# EAGLE schematic test_esp32 (EAGLE 7.5.0)
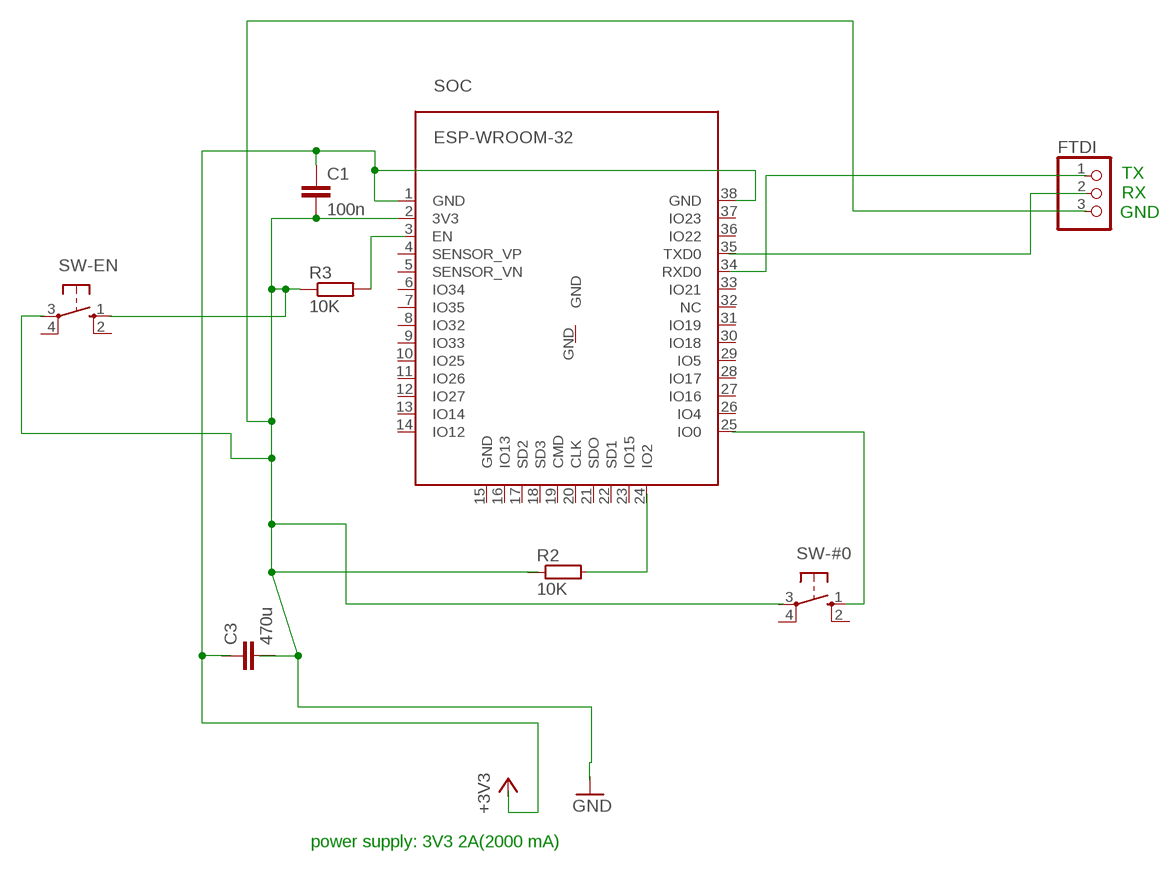
[diagram p0: schematic, sheet 1]

## Parts
C1  100n  C-EUC0603  [C0603]
C3  470u  C-EUC1206  [C1206]
FTDI  PINHD-1X3  [1X03]
R2  10K  R-EU_R0603  [R0603]
R3  10K  R-EU_R0603  [R0603]
SOC  ESP-WROOM-32  [ESP-WROOM-32]
SW-#0  10-XX  [B3F-10XX]
SW-EN  10-XX  [B3F-10XX]

## Nets
N$2: C1.1 SOC.1(GND) SOC.38(GND)
N$4: R3.2
N$9: C1.2 R3.1 SOC.2(3V3)
Unconnected: C3.1 C3.2 FTDI.1 FTDI.2 FTDI.3 R2.1 R2.2 SOC.3(EN) SOC.4(SENSOR_VP) SOC.5(SENSOR_VN) SOC.6(IO34) SOC.7(IO35) SOC.8(IO32) SOC.9(IO33) SOC.10(IO25) SOC.11(IO26) SOC.12(IO27) SOC.13(IO14) SOC.14(IO12) SOC.15(GND) SOC.16(IO13) SOC.17(SD2) SOC.18(SD3) SOC.19(CMD) SOC.20(CLK) SOC.21(SDO) SOC.22(SD1) SOC.23(IO15) SOC.24(IO2) SOC.25(IO0) SOC.26(IO4) SOC.27(IO16) SOC.28(IO17) SOC.29(IO5) SOC.30(IO18) SOC.31(IO19) SOC.32(NC) SOC.33(IO21) SOC.34(RXD0) SOC.35(TXD0) SOC.36(IO22) SOC.37(IO23) SOC.GND SW-#0.1(S) SW-#0.2(S1) SW-#0.3(P) SW-#0.4(P1) SW-EN.1(S) SW-EN.2(S1) SW-EN.3(P) SW-EN.4(P1)

## Notes on the sheet
- TX
- RX
- GND
- power supply: 3V3 2A(2000 mA)

## Library data of the parts
C1 C3 = resistor:C-EU: CAPACITOR, European symbol
FTDI = pinhead:PINHD-1X3: PIN HEADER
R2 R3 = resistor:R-EU_: RESISTOR, European symbol
SOC = esp32-ex:ESP-WROOM-32
SW-#0 SW-EN = switch-omron:10-XX: OMRON SWITCH; MPN: B3F-1000; OC_FARNELL: 176432; OC_NEWARK: 36M3542